# EAGLE schematic tarjeta2 (EAGLE 9.1.3)
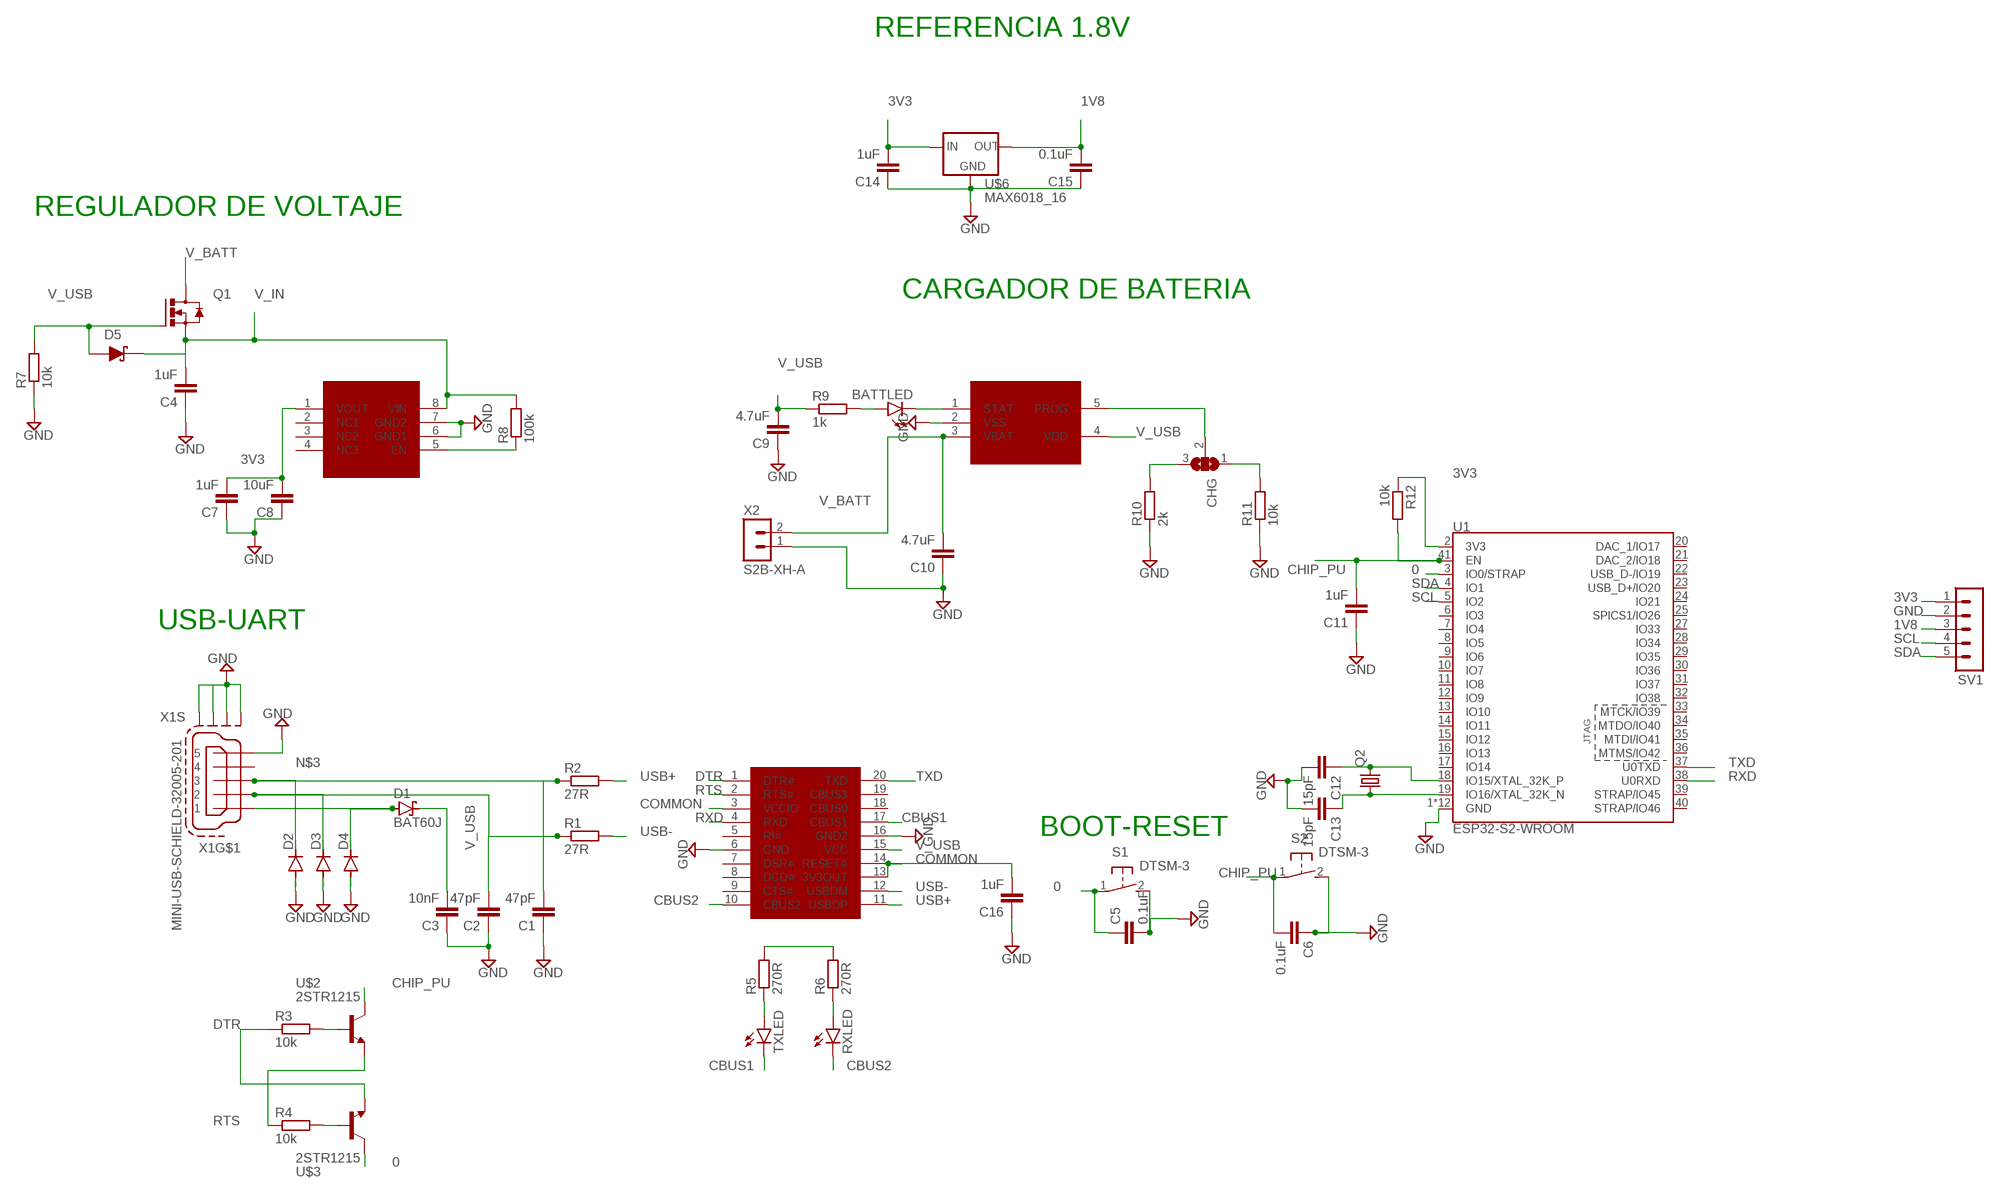
[diagram p0: schematic, sheet 1]

## Parts
BATTLED  LEDSML0603  [SML0603]
C1  47pF  C-EUC0805  [C0805]
C2  47pF  C-EUC0805  [C0805]
C3  10nF  C-EUC0805  [C0805]
C4  1uF  C-EUC0805  [C0805]
C5  0.1uF  C-EUC0805  [C0805]
C6  0.1uF  C-EUC0805  [C0805]
C7  1uF  C-EUC0805  [C0805]
C8  10uF  C-EUC0805  [C0805]
C9  4.7uF  C-EUC0805  [C0805]
C10  4.7uF  C-EUC0805  [C0805]
C11  1uF  C-EUC0805  [C0805]
C12  15pF  C-EUC0805  [C0805]
C13  15pF  C-EUC0805  [C0805]
C14  1uF  C-EUC0805  [C0805]
C15  0.1uF  C-EUC0805  [C0805]
C16  1uF  C-EUC0805  [C0805]
CHG  SJ2W  [SJ_2]
D1  BAT60J  [SOD323_ST]
D2  DIODE-SOD523  [SOD523]
D3  DIODE-SOD523  [SOD523]
D4  DIODE-SOD523  [SOD523]
D5  D_SCHOTTKYK  [SOD-123]
Q1  MOSFET_N_SOT231  [SOT23]
Q2  CRYSTALTC26V  [TC26V]
R1  27R  R-EU_R0805  [R0805]
R2  27R  R-EU_R0805  [R0805]
R3  10k  R-EU_R0805  [R0805]
R4  10k  R-EU_R0805  [R0805]
R5  270R  R-EU_R0805  [R0805]
R6  270R  R-EU_R0805  [R0805]
R7  10k  R-EU_R0805  [R0805]
R8  100k  R-EU_R0805  [R0805]
R9  1k  R-EU_R0805  [R0805]
R10  2k  R-EU_R0805  [R0805]
R11  10k  R-EU_R0805  [R0805]
R12  10k  R-EU_R0805  [R0805]
RXLED  LEDSML0603  [SML0603]
S1  DTSM-3  [DTSM-3]
S2  DTSM-3  [DTSM-3]
SV1  MA05-1  [MA05-1]
TXLED  LEDSML0603  [SML0603]
U1  ESP32-S2-WROOM  [ESP32-S2-WROOM]
U$1  FT231XS-R  [SSOP20]
U$2  2STR1215  [SOT23]
U$3  2STR1215  [SOT23]
U$4  AP2112-3.3  [SOIC8]
U$5  MCP73831/2  [SOT23-5]
U$6  MAX6018_16  [SOT23]
X1  MINI-USB-SCHIELD-32005-201  [32005-201]
X2  S2B-XH-A  [S2B-XH-A]

## Nets
0: C5.1 S1.1 U1.3(IO0/STRAP) U$3.3(C)
1V8: C15.2 SV1.3 U$6.2(OUT)
3V3: C7.2 C8.2 C14.2 R12.1 SV1.1 U1.2(3V3) U$4.1(VOUT) U$6.1(IN)
CBUS1: TXLED.C U$1.17(CBUS1)
CBUS2: RXLED.C U$1.10(CBUS2)
CHIP_PU: C6.2 C11.2 R12.2 S2.1 U1.41(EN) U$2.3(C)
COMMON: C16.2 U$1.3(VCCIO) U$1.13(3V3OUT) U$1.14(RESET#)
DTR: R3.1 U$1.1(DTR#) U$3.2(E)
GND: C1.1 C2.1 C3.1 C4.1 C5.2 C6.1 C7.1 C8.1 C9.1 C10.1 C11.1 C12.2 C13.2 C14.1 C15.1 C16.1 D2.A D3.A D4.A R7.1 R10.1 R11.1 S1.2 S2.2 SV1.2 U1.1(GND) U1.26(GND) U1.42(GND) U1.GNDEP0(GND) U1.GNDEP1(GND) U1.GNDEP2(GND) U1.GNDEP3(GND) U1.GNDEP4(GND) U1.GNDEP5(GND) U1.GNDEP6(GND) U1.GNDEP7(GND) U1.GNDEP8(GND) U$1.6(GND) U$1.16(GND2) U$4.6(GND1) U$4.7(GND2) U$5.2(VSS) U$6.3(GND) X1.5 X1.M1(S:S1) X1.M2(S:S2) X1.M3(S:S3) X1.M4(S:S4) X2.1
N$1: D1.A D4.C X1.1
N$2: C2.2 D3.C R1.1 X1.2
N$3: C1.2 D2.C R2.1 X1.3
N$4: R3.2 U$2.1(B)
N$5: R4.2 U$3.1(B)
N$6: R5.1 TXLED.A
N$7: R6.1 RXLED.A
N$8: BATTLED.A R9.2
N$9: R8.1 U$4.5(EN)
N$10: BATTLED.C U$5.1(STAT)
N$12: CHG.2 U$5.5(PROG)
N$13: CHG.3 R10.2
N$14: CHG.1 R11.2
N$15: C12.1 Q2.2 U1.18(IO15/XTAL_32K_P)
N$16: C13.1 Q2.1 U1.19(IO16/XTAL_32K_N)
RTS: R4.1 U$1.2(RTS#) U$2.2(E)
RXD: U1.38(U0RXD) U$1.4(RXD)
SCL: SV1.4 U1.5(IO2)
SDA: SV1.5 U1.4(IO1)
TXD: U1.37(U0TXD) U$1.20(TXD)
USB+: R2.2 U$1.11(USBDP)
USB-: R1.2 U$1.12(USBDM)
V_BATT: C10.2 Q1.3(D) U$5.3(VBAT) X2.2
V_IN: C4.2 D5.2(C) Q1.2(S) R8.2 U$4.8(VIN)
V_USB: C3.2 C9.2 D1.C D5.1(A) Q1.1(G) R5.2 R6.2 R7.2 R9.1 U$1.15(VCC) U$5.4(VDD)
Unconnected: U1.6(IO3) U1.7(IO4) U1.8(IO5) U1.9(IO6) U1.10(IO7) U1.11(IO8) U1.12(IO9) U1.13(IO10) U1.14(IO11) U1.15(IO12) U1.16(IO13) U1.17(IO14) U1.20(DAC_1/IO17) U1.21(DAC_2/IO18) U1.22(USB_D-/IO19) U1.23(USB_D+/IO20) U1.24(IO21) U1.25(SPICS1/IO26) U1.27(IO33) U1.28(IO34) U1.29(IO35) U1.30(IO36) U1.31(IO37) U1.32(IO38) U1.33(MTCK/IO39) U1.34(MTDO/IO40) U1.35(MTDI/IO41) U1.36(MTMS/IO42) U1.39(STRAP/IO45) U1.40(STRAP/IO46) U$1.5(RI#) U$1.7(DSR#) U$1.8(DCD#) U$1.9(CTS#) U$1.18(CBUS0) U$1.19(CBUS3) U$4.2(NC1) U$4.3(NC2) U$4.4(NC3) X1.4

## Notes on the sheet
- REFERENCIA 1.8V
- REGULADOR DE VOLTAJE
- CARGADOR DE BATERIA
- USB-UART
- BOOT-RESET

## Library data of the parts
BATTLED RXLED TXLED = led:LED: LED OSRAM: - CHIPLED LG R971, LG N971, LY N971, LG Q971, LY Q971, LO R971, LY R971 LH N974, LH R974 LS Q976, LO Q976, LY Q976 LO Q996 - Hyper CHIPLED LW Q18S LB Q993, LB Q99A, LB R99A - SideLED LS A670, LO A670, LY A670, LG A670, LP A670 LB A673, LV A673, LT A673, LW A673 LH A674 LY A675 LS A676, LA A676, LO A676, LY A676, LW A676 LS A679, LY A679, LG A679 - Hyper Micro SIDELED® LS Y876, LA Y876, LO Y876, LY Y876 LT Y87S - SmartLED LW L88C, LW L88S LB L89C, LB L89S, LG L890 LS L89K, LO L89K, LY L89K LS L896, LA L896, LO L896, LY L896 - TOPLED LS T670, LO T670, LY T670, LG T670, LP T670 LSG T670, LSP T670, LSY T670, LOP T670, LYG T670 LG T671, LOG T671, LSG T671 LB T673, LV T673, LT T673, LW T673 LH T674 LS T676, LA T676, LO T676, LY T676, LB T676, LH T676, LSB T676, LW T676 LB T67C, LV T67C, LT T67C, LS T67K, LO T67K, LY T67K, LW E67C LS E67B, LA E67B, LO E67B, LY E67B, LB E67C, LV E67C, LT E67C LW T67C LS T679, LY T679, LG T679 LS T770, LO T770, LY T770, LG T770, LP T770 LB T773, LV T773, LT T773, LW T773 LH T774 LS E675, LA E675, LY E675, LS T675 LS T776, LA T776, LO T776, LY T776, LB T776 LHGB T686 LT T68C, LB T68C - Hyper Mini TOPLED® LB M676 - Mini TOPLED Santana® LG M470 LS M47K, LO M47K, LY M47K Source: http://www.osram.convergy.de LUXEON: - LUMILED® LXK2-PW12-R00, LXK2-PW12-S00, LXK2-PW14-U00, LXK2-PW14-V00 LXK2-PM12-R00, LXK2-PM12-S00, LXK2-PM14-U00 LXK2-PE12-Q00, LXK2-PE12-R00, LXK2-PE12-S00, LXK2-PE14-T00, LXK2-PE14-U00 LXK2-PB12-K00, LXK2-PB12-L00, LXK2-PB12-M00, LXK2-PB14-N00, LXK2-PB14-P00, LXK2-PB14-Q00 LXK2-PR12-L00, LXK2-PR12-M00, LXK2-PR14-Q00, LXK2-PR14-R00 LXK2-PD12-Q00, LXK2-PD12-R00, LXK2-PD12-S00 LXK2-PH12-R00, LXK2-PH12-S00 LXK2-PL12-P00, LXK2-PL12-Q00, LXK2-PL12-R00 Source: www.luxeon.com KINGBRIGHT: KA-3528ASYC Source: www.kingbright.com
C1-C16 = resistor:C-EU: CAPACITOR, European symbol
CHG = jumper:SJ2W: SMD solder JUMPER
D1 = diode:BAT60J: Schottky barrier diode Source: www.st.com, BAT60J.pdf
D2-D4 = diode:DIODE-: DIODE
D5 = m-pad-2.1:D_SCHOTTKY: Schottky diodes in various packages
Q1 = m-pad-2.1:MOSFET_N_SOT23: n channel mosfets in the sot-23 package standard pinout ie. fairchildsemi.com: FDN327N FDN335N FDN337N FDN372S NDS355AN etc. ie fairchild at digikey: FDV303N NDS351N NDS355N etc.
Q2 = crystal:CRYSTAL: CRYSTAL; OC_FARNELL: unknown; OC_NEWARK: unknown
R1-R12 = rcl:R-EU_: RESISTOR, European symbol; SPICEPREFIX: R
S1 S2 = switch-tact:DTSM-3
SV1 = con-lstb:MA05-1: PIN HEADER; OC_FARNELL: unknown; OC_NEWARK: unknown
U1 = esp32-s2-wroom:ESP32-S2-WROOM: ESP32-S2-WROOM - trace antenna (includes keepout); PROD_ID: IC-15599
U$1 = FT231XS-R:FT231XS-R
U$2 U$3 = 2STR1215:2STR1215
U$4 = AP2112-3.3:AP2112-3.3
U$5 = MCP73831:MCP73831/2
U$6 = MAX6018_16:MAX6018_16
X1 = con-cypressindustries:MINI-USB-SCHIELD-: MINI USB-B Conector Source: www.cypressindustries.com; OC_FARNELL: unknown; OC_NEWARK: unknown
X2 = con-JST XH:S2B-XH: JST XH series header 2.50mm pitch disconnectable crimp style connectors, horizontal (side entry type), 2 pins